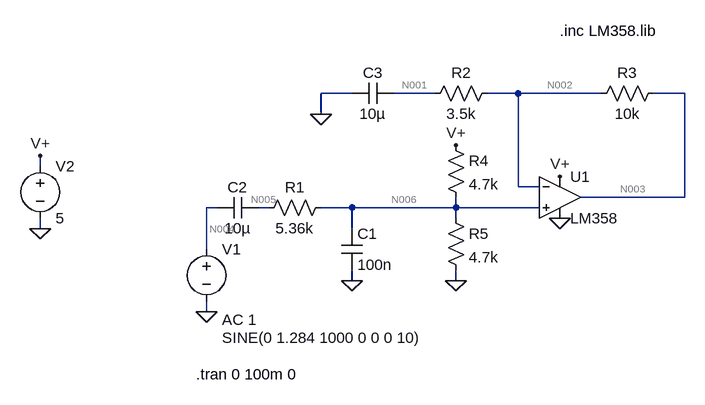
[diagram p0: schematic lm358.asc]
lm358.asc, the LTspice schematic file:
Version 4
SHEET 1 1036 680
WIRE 320 -128 272 -128
WIRE 448 -128 384 -128
WIRE 576 -128 528 -128
WIRE 704 -128 576 -128
WIRE 832 -128 784 -128
WIRE 272 -96 272 -128
WIRE -160 -16 -160 -32
WIRE 576 16 576 -128
WIRE 608 16 576 16
WIRE 832 32 832 -128
WIRE 832 32 672 32
WIRE 112 48 96 48
WIRE 192 48 176 48
WIRE 320 48 272 48
WIRE 480 48 480 32
WIRE 480 48 320 48
WIRE 608 48 480 48
WIRE 480 64 480 48
WIRE -160 80 -160 64
WIRE 320 80 320 48
WIRE 96 112 96 48
WIRE 320 160 320 144
WIRE 480 160 480 144
WIRE 96 208 96 192
FLAG -160 80 0
FLAG 96 208 0
FLAG 320 160 0
FLAG 272 -96 0
FLAG 640 64 0
FLAG -160 -32 V+
FLAG 640 0 V+
FLAG 480 160 0
FLAG 480 -48 V+
SYMBOL voltage 96 96 R0
WINDOW 123 24 124 Left 2
WINDOW 39 0 0 Left 2
WINDOW 3 24 152 Left 2
SYMATTR Value2 AC 1
SYMATTR Value SINE(0 1.284 1000 0 0 0 10)
SYMATTR InstName V1
SYMBOL voltage -160 -32 R0
WINDOW 123 0 0 Left 2
WINDOW 39 0 0 Left 2
SYMATTR InstName V2
SYMATTR Value 5
SYMBOL res 288 32 R90
WINDOW 0 0 56 VBottom 2
WINDOW 3 32 56 VTop 2
SYMATTR InstName R1
SYMATTR Value 5.36k
SYMBOL cap 304 80 R0
SYMATTR InstName C1
SYMATTR Value 100n
SYMBOL res 544 -144 R90
WINDOW 0 0 56 VBottom 2
WINDOW 3 32 56 VTop 2
SYMATTR InstName R2
SYMATTR Value 3.5k
SYMBOL res 800 -144 R90
WINDOW 0 0 56 VBottom 2
WINDOW 3 32 56 VTop 2
SYMATTR InstName R3
SYMATTR Value 10k
SYMBOL Opamps\\opamp2 640 -32 R0
SYMATTR InstName U1
SYMATTR Value LM358
SYMBOL cap 176 32 R90
WINDOW 0 0 32 VBottom 2
WINDOW 3 32 32 VTop 2
SYMATTR InstName C2
SYMATTR Value 10µ
SYMBOL res 464 -64 R0
SYMATTR InstName R4
SYMATTR Value 4.7k
SYMBOL res 464 48 R0
SYMATTR InstName R5
SYMATTR Value 4.7k
SYMBOL cap 384 -144 R90
WINDOW 0 0 32 VBottom 2
WINDOW 3 32 32 VTop 2
SYMATTR InstName C3
SYMATTR Value 10µ
TEXT 640 -224 Left 2 !.inc LM358.lib
TEXT 80 304 Left 2 !.tran 0 100m 0

The netlist it stands for:
* lm358.asc
V1 N004 0 SINE(0 1.284 1000 0 0 0 10) AC 1
V2 V+ 0 5
R1 N006 N005 5.36k
C1 N006 0 100n
R2 N002 N001 3.5k
R3 N003 N002 10k
XU1 N006 N002 V+ 0 N003 LM358  ; pins In+ In- V+ V- OUT
C2 N005 N004 10µ
R4 V+ N006 4.7k
R5 N006 0 4.7k
C3 N001 0 10µ
.inc LM358.lib
.tran 0 100m 0
.backanno
.end

* Results of the author's LTspice run, read from the files saved beside the schematic
* Operating Point, zero values left out:
*   V(v+) = 5 V
*   V(n006) = 2.5 V
*   V(n005) = 2.5 V
*   V(n002) = 2.502 V
*   V(n001) = 2.502 V
*   V(n003) = 2.502 V
*   I(R5) = 531.9 µA
*   I(R4) = 531.9 µA
*   I(R3) = -37.96 nA
*   I(V2) = -485.5 µA
*   Ix(u1:1) = -51.96 nA
*   Ix(u1:2) = -37.96 nA
*   Ix(u1:99) = -46.42 µA
*   Ix(u1:50) = 46.47 µA
*   Ix(u1:28) = 37.96 nA
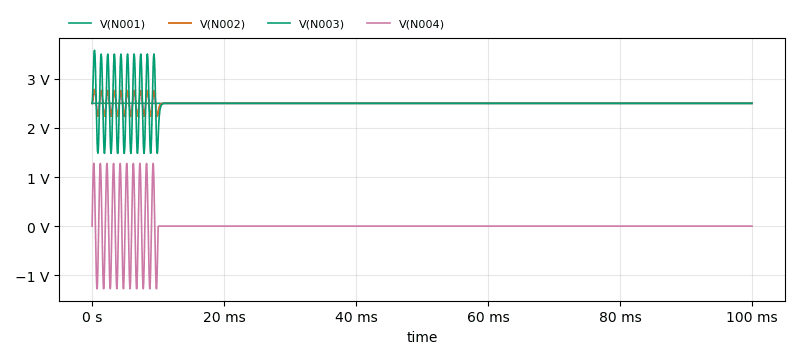
[diagram p1: Transient Analysis of lm358.asc, plotted from the saved traces]
* Transient Analysis, 1 run:
*   V(N001): min 2.502 V, max 2.505 V, average 2.502 V, rms 2.502 V, last 2.502 V
*   V(N002): min 2.239 V, max 2.783 V, average 2.502 V, rms 2.503 V, last 2.502 V
*   V(N003): min 1.482 V, max 3.582 V, average 2.502 V, rms 2.512 V, last 2.502 V
*   V(N004): min -1.278 V, max 1.28 V, average -17.87 µV, rms 284.5 mV, last 0 V